# Altium schematic sheet LAN.SchDoc
size A4; SheetNumber: 4; SheetTotal: 8
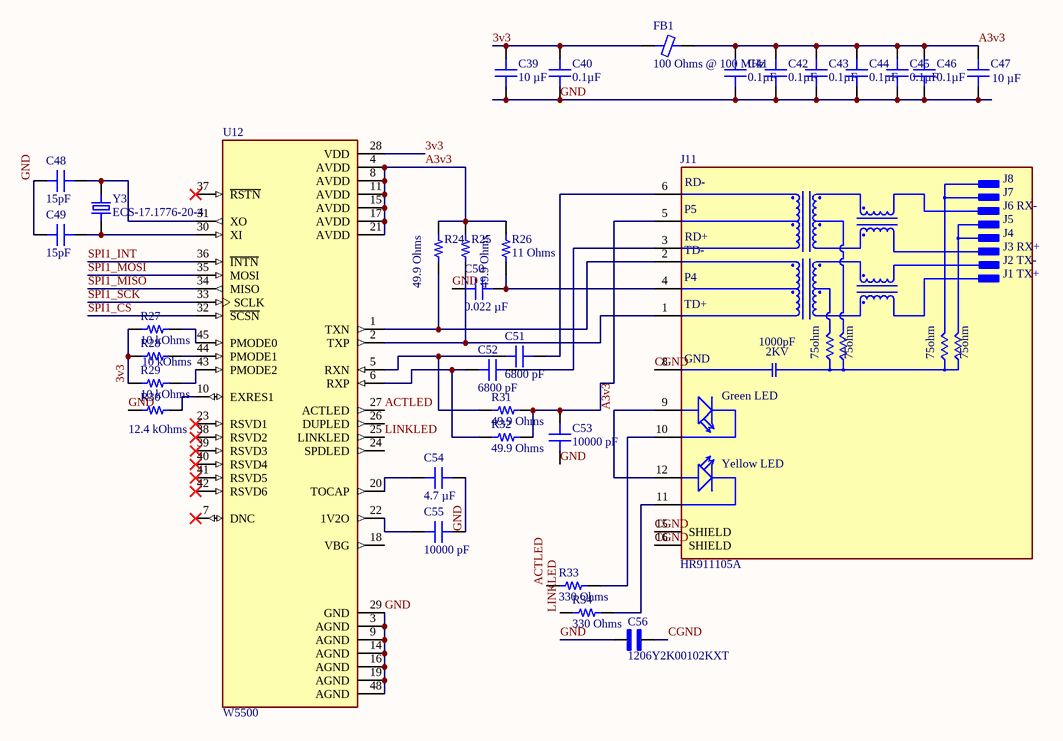
[diagram p0: LAN.SchDoc]

## Parts
C39  10 µF  [CAP 1206_3216 - 0.8MM]
C40  Capacitance: 0.1µF  [CAP 0805_2012]  (hidden comment: 1µF)
C41  Capacitance: 0.1µF  [CAP 0805_2012]  (hidden comment: 1µF)
C42  Capacitance: 0.1µF  [CAP 0805_2012]  (hidden comment: 1µF)
C43  Capacitance: 0.1µF  [CAP 0805_2012]  (hidden comment: 1µF)
C44  Capacitance: 0.1µF  [CAP 0805_2012]  (hidden comment: 1µF)
C45  Capacitance: 0.1µF  [CAP 0805_2012]  (hidden comment: 1µF)
C46  Capacitance: 0.1µF  [CAP 0805_2012]  (hidden comment: 1µF)
C47  10 µF  [CAP 1206_3216 - 0.8MM]
C48  15pF  [CAP 0805_2012]
C49  15pF  [CAP 0805_2012]
C50  0.022 µF  [CAP 0805_2012]
C51  6800 pF  [CAP 0805_2012]
C52  6800 pF  [CAP 0805_2012]
C53  10000 pF  [CAP 0805_2012]
C54  4.7 µF  [CAP 0805_2012]
C55  10000 pF  [CAP 0805_2012]
C56  1206Y2K00102KXT  [CAPC3216X160N]
FB1  100 Ohms @ 100 MHz  [FER 0805_2012]
J11  HR911105A  [HANRUN_HR911105A]
R24  49.9 Ohms  [RES 0805_2012]
R25  49.9 Ohms  [RES 0805_2012]
R26  11 Ohms  [RES 0805_2012]
R27  10 kOhms  [RES 0805_2012]
R28  10 kOhms  [RES 0805_2012]
R29  10 kOhms  [RES 0805_2012]
R30  12.4 kOhms  [RES 0805_2012]
R31  49.9 Ohms  [RES 0805_2012]
R32  49.9 Ohms  [RES 0805_2012]
R33  330 Ohms  [YAGEO RES 0805_2012]
R34  330 Ohms  [YAGEO RES 0805_2012]
U12  W5500  [QFP50P900X900X160-48N]
Y3  ECS-17.1776-20-4  [XTAL_ECS-160-20-4X]

## Nets
3v3: C39.2 C40.2 FB1.1 R27.1 R28.1 R29.1 U12.28(VDD)
A3v3: C41.2 C42.2 C43.2 C44.2 C45.2 C46.2 C47.2 FB1.2 J11.9(GA) J11.12(YA) R24.2 R25.2 R26.2 U12.4(AVDD) U12.8(AVDD) U12.11(AVDD) U12.15(AVDD) U12.17(AVDD) U12.21(AVDD)
ACTLED: R33.1 U12.27(ACTLED)
CGND: C56.2 J11.8(GND) J11.15(SHIELD) J11.16(SHIELD)
GND: C39.1 C40.1 C41.1 C42.1 C43.1 C44.1 C45.1 C46.1 C47.1 C48.1 C49.1 C50.2 C53.1 C54.2 C55.2 C56.1 R30.1 U12.3(AGND) U12.9(AGND) U12.14(AGND) U12.16(AGND) U12.19(AGND) U12.29(GND) U12.48(AGND)
LINKLED: R34.1 U12.25(LINKLED)
SPI1_CS: U12.32(~{SCSN})
SPI1_INT: U12.36(~{INTN})
SPI1_MISO: U12.34(MISO)
SPI1_MOSI: U12.35(MOSI)
SPI1_SCK: U12.33(SCLK)
NetC48_2: C48.2 U12.31(XO) Y3.2
NetC49_2: C49.2 U12.30(XI) Y3.1
NetC50_1: C50.1 J11.4(P4) R26.1
NetC51_1: C51.1 R31.2 U12.5(RXN)
NetC51_2: C51.2 J11.6(RD-)
NetC52_1: C52.1 R32.2 U12.6(RXP)
NetC52_2: C52.2 J11.3(RD+)
NetC53_2: C53.2 J11.5(P5) R31.1 R32.1
NetC54_1: C54.1 U12.20(TOCAP)
NetC55_1: C55.1 U12.22(1V2O)
NetJ11_1: J11.1(TD+) R25.1 U12.2(TXP)
NetJ11_2: J11.2(TD-) R24.1 U12.1(TXN)
NetJ11_10: J11.10(GC) R33.2
NetJ11_11: J11.11(YC) R34.2
NetR27_2: R27.2 U12.45(PMODE0)
NetR28_2: R28.2 U12.44(PMODE1)
NetR29_2: R29.2 U12.43(PMODE2)
NetR30_2: R30.2 U12.10(EXRES1)

Not connected (* = marked no-connect by the designer): U12 7(DNC)* 18(VBG) 23(RSVD1)* 24(SPDLED) 26(DUPLED) 37(~{RSTN})* 38(RSVD2)* 39(RSVD3)* 40(RSVD4)* 41(RSVD5)* 42(RSVD6)*

## Notes on the sheet
- (in symbol HR911105A) J8; J7; J6 RX-; J5; J4; J3 RX+; J2 TX-; J1 TX+; 1000pF; 2KV; 75ohm; Green LED; Yellow LED

## Library data of the parts
C39 C47 = EMK316BJ106MD-T: CAP CER 10UF 16V X5R 1206; manufacturer: Taiyo Yuden; Tolerance: ±20%; Part Number: EMK316BJ106MD-T; Capacitance: 10 µF; Applications: SMPS Filtering; componentlink1description: Datasheet; componentlink1url: http://www.yuden.co.jp/productdata/catalog/mlcc06_e.pdf; componentlink2description: DigiKey Link; componentlink2url: https://www.digikey.com/en/products/detail/taiyo-yuden/EMK316BJ106MD-T/6563474; Device Package: 1206 (3216 Metric); lastupdated: 04-06-2024 7.10.41 PM; Lifecycle Status: Active; Minimum Order: 1; Mounting Type: Surface Mount, MLCC; Operating Temperature: -55°C ~ 85°C; Package / Case: 1206 (3216 Metric); packaging: TapeAndReel; partid: 18996; Part Status: Active; price: 0.04; series: M; Size / Dimension: 0.126" L x 0.063" W (3.20mm x 1.60mm); Supplier 1: DigiKey; Supplier Part Number 1: 587-4881-1-ND; Temperature Coefficient: X5R; Thickness (Max): 0.037" (0.95mm); value: 10 µF; Voltage - Rated: 16V
C40-C46 = 0805ZC105KAT4A: CAP CER 1UF 10V X7R 0805; manufacturer: AVX Corporation; Tolerance: ±10%; Part Number: 0805ZC105KAT4A; Applications: General Purpose; componentlink1description: Datasheet; componentlink1url: http://datasheets.avx.com/X7RDielectric.pdf; componentlink2description: DigiKey Link; componentlink2url: http://digikey.com/product-detail/en/avx-corporation/0805ZC105KAT4A/478-7604-1-ND/7536237; Device Package: 0805 (2012 Metric); lastupdated: 02-09-2020 1.04.40 AM; Lifecycle Status: Active; Minimum Order: 1; Mounting Type: Surface Mount, MLCC; Operating Temperature: -55°C ~ 125°C; Package / Case: 0805 (2012 Metric); packaging: TapeAndReel; partid: 3500; Part Status: Active; price: 0.17; series: -; Size / Dimension: 0.079" L x 0.049" W (2.00mm x 1.25mm); Supplier 1: DigiKey; Supplier Part Number 1: 478-7604-1-ND; Temperature Coefficient: X7R; Thickness (Max): 0.037" (0.94mm); value: 1µF; Voltage - Rated: 10V
C48 C49 = 08055A150JAT2A: CAP CER 15PF 50V C0G/NP0 0805; manufacturer: AVX Corporation; Temperature Coefficient: C0G, NP0; Tolerance: ±5%; Part Number: 08055A150JAT2A; Capacitance: 15pF; Applications: General Purpose; componentlink1description: Datasheet; componentlink1url: http://datasheets.avx.com/C0GNP0-Dielectric.pdf; componentlink2description: DigiKey Link; componentlink2url: http://digikey.com/product-detail/en/avx-corporation/08055A150JAT2A/478-1306-1-ND/564338; Device Package: 0805 (2012 Metric); lastupdated: 02-09-2020 1.04.40 AM; Lifecycle Status: Active; Minimum Order: 1; Mounting Type: Surface Mount, MLCC; Operating Temperature: -55°C ~ 125°C; Package / Case: 0805 (2012 Metric); packaging: TapeAndReel; partid: 3213; Part Status: Active; price: 0.02; series: -; Size / Dimension: 0.079" L x 0.049" W (2.01mm x 1.25mm); Supplier 1: DigiKey; Supplier Part Number 1: 478-1306-1-ND; Thickness (Max): 0.037" (0.94mm); value: 15pF; Voltage - Rated: 50V
C50 = C0805C223K5RECAUTO: CAP CER 0805 22NF 50V X7R 10%; manufacturer: KEMET; Part Number: C0805C223K5RECAUTO; Capacitance: 0.022 µF; Applications: Automotive, ESD Protection; componentlink1description: Datasheet; componentlink1url: https://api.kemet.com/component-edge/download/datasheet/C0805C223K5RECAUTO.pdf; componentlink2description: DigiKey Link; componentlink2url: https://www.digikey.com/en/products/detail/kemet/C0805C223K5RECAUTO/8640480; Device Package: 0805 (2012 Metric); lastupdated: 09-02-2024 8.15.30 PM; Lifecycle Status: Active; Minimum Order: 1; Mounting Type: Surface Mount, MLCC; Operating Temperature: -55°C ~ 125°C; Package / Case: 0805 (2012 Metric); packaging: TapeAndReel; partid: 15719; Part Status: Active; price: 0.04; Ratings: AEC-Q200; series: ESD SMD Auto X7R; Size / Dimension: 0.079" L x 0.049" W (2.00mm x 1.25mm); Supplier 1: DigiKey; Supplier Part Number 1: 399-17886-1-ND; Temperature Coefficient: X7R; Thickness (Max): 0.035" (0.88mm); Tolerance: ±10%; value: 0.022 µF; Voltage - Rated: 50V
C51 C52 = C0805C682M3GEC7800: CAP CER 0805 6.8NF 25V C0G 20%; manufacturer: KEMET; Temperature Coefficient: C0G, NP0; Part Number: C0805C682M3GEC7800; Capacitance: 6800 pF; Applications: ESD Protection; componentlink1description: Datasheet; componentlink1url: https://connect.kemet.com:7667/gateway/IntelliData-ComponentDocumentation/1.0/download/datasheet/C0805C682M3GEC7800; componentlink2description: DigiKey Link; componentlink2url: https://www.digikey.com/en/products/detail/kemet/C0805C682M3GEC7800/8644610; Device Package: 0805 (2012 Metric); Features: Low ESL; lastupdated: 09-02-2024 8.14.56 PM; Lifecycle Status: Active; Minimum Order: 1; Mounting Type: Surface Mount, MLCC; Operating Temperature: -55°C ~ 125°C; Package / Case: 0805 (2012 Metric); packaging: TapeAndReel; partid: 46454; Part Status: Active; price: 0.06; series: ESD SMD Comm C0G; Size / Dimension: 0.079" L x 0.049" W (2.00mm x 1.25mm); Supplier 1: DigiKey; Supplier Part Number 1: 399-C0805C682M3GEC7800CT-ND; Thickness (Max): 0.055" (1.40mm); Tolerance: ±20%; value: 6800 pF; Voltage - Rated: 25V
C53 C55 = C0805X103K1RAC3316: CAP CER 0805 10NF 100V X7R; manufacturer: KEMET; Tolerance: ±10%; Part Number: C0805X103K1RAC3316; Capacitance: 10000 pF; Applications: Automotive, Boardflex Sensitive; componentlink1description: Datasheet; componentlink1url: https://api.kemet.com/component-edge/download/datasheet/C0805X103K1RAC3316.pdf; componentlink2description: DigiKey Link; componentlink2url: https://www.digikey.com/en/products/detail/kemet/C0805X103K1RAC3316/10315780; Device Package: 0805 (2012 Metric); Features: Soft Termination; lastupdated: 09-02-2024 8.16.09 PM; Lifecycle Status: Active; Minimum Order: 1; Mounting Type: Surface Mount, MLCC; Operating Temperature: -55°C ~ 125°C; Package / Case: 0805 (2012 Metric); packaging: TapeAndReel; partid: 2565; Part Status: Active; price: 0.02; Ratings: AEC-Q200; series: SMD Auto X7R VW80808; Size / Dimension: 0.079" L x 0.049" W (2.00mm x 1.25mm); Supplier 1: DigiKey; Supplier Part Number 1: 399-C0805X103K1RAC3316CT-ND; Temperature Coefficient: X7R; Thickness (Max): 0.039" (0.98mm); value: 10000 pF; Voltage - Rated: 100V
C54 = C0805X475M3RAC7800: 4.70UF 25.0V; manufacturer: KEMET; Temperature Coefficient: X7R; Tolerance: ±20%; Voltage - Rated: 25V; Part Number: C0805X475M3RAC7800; Capacitance: 4.7 µF; Applications: Boardflex Sensitive; componentlink1description: Datasheet; componentlink1url: https://connect.kemet.com:7667/gateway/IntelliData-ComponentDocumentation/1.0/download/datasheet/C0805X475M3RAC7800; componentlink2description: DigiKey Link; componentlink2url: https://www.digikey.com/en/products/detail/kemet/C0805X475M3RAC7800/12082671; Device Package: 0805 (2012 Metric); Features: Soft Termination; lastupdated: 09-02-2024 8.14.56 PM; Lifecycle Status: Active; Minimum Order: 1; Mounting Type: Surface Mount, MLCC; Operating Temperature: -55°C ~ 125°C; Package / Case: 0805 (2012 Metric); packaging: TapeAndReel; partid: 46494; Part Status: Active; price: 0.14; series: SMD Comm X7R Flex; Size / Dimension: 0.079" L x 0.049" W (2.00mm x 1.25mm); Supplier 1: DigiKey; Supplier Part Number 1: 399-C0805X475M3RAC7800CT-ND; Thickness (Max): 0.057" (1.45mm); value: 4.7 µF
C56 = 1206Y2K00102KXT: 1000 pF Â±10% 2000V (2kV) Ceramic Capacitor X7R 1206 (3216 Metric); MF: Knowles Syfer; SnapEDA_Link: https://www.snapeda.com/parts/1206Y2K00102KXT/Knowles+Syfer/view-part/?ref=snap; Package: 3216 Knowles Syfer; Value: *; MP: 1206Y2K00102KXT; Check_prices: https://www.snapeda.com/parts/1206Y2K00102KXT/Knowles+Syfer/view-part/?ref=eda
FB1 = HRB0805S101K1.00FT: FERRITE BEAD, CHIP, 0805, 100 OH; Manufacturer: AEM, Inc.; Current Rating (Max): 1A; DC Resistance (DCR) (Max): 200mOhm; Number of Lines: 1; Part Number: HRB0805S101K1.00FT; ComponentLink2Description: DigiKey Link; ComponentLink2URL: https://www.digikey.com/en/products/detail/aem-inc/HRB0805S101K1-00FT/23025488; Device Package: 0805 (2012 Metric); Height (Max): 0.043" (1.10mm); Impedance @ Frequency: 100 Ohms @ 100 MHz; LastUpdated: 29-03-2026 8.09.51 PM; Lifecycle Status: Active; Minimum Order: 1; Mounting Type: Surface Mount; Operating Temperature: -55°C ~ 125°C; Package / Case: 0805 (2012 Metric); Packaging: TapeAndReel; PartId: 4402; Price: 158.37; Series: HRB; Size / Dimension: 0.079" L x 0.049" W (2.00mm x 1.25mm); Supplier 1: DigiKey; Supplier Part Number 1: 5433-HRB0805S101K1.00FTCT-ND; Value: 100 Ohms @ 100 MHz
J11 = HR911105A: DIP RJ45 Connector;; MF: hanrun; SnapEDA_Link: https://www.snapeda.com/parts/HR911105A/HanRun/view-part/?ref=snap; Package: None; MP: HR911105A; Check_prices: https://www.snapeda.com/parts/HR911105A/HanRun/view-part/?ref=eda; Price: None; Value: *; Availability: Not in stock
R24 R25 R31 R32 = RCC080549R9FKEA: RCC0805 100 49R9 1% ET1 E3; Manufacturer: Vishay Dale; Power (Watts): 0.25W, 1/4W; Temperature Coefficient: ±100ppm/°C; Part Number: RCC080549R9FKEA; Value: 49.9 Ohms; ComponentLink1Description: Datasheet; ComponentLink1URL: https://www.vishay.com/docs/20066/rcce3.pdf; ComponentLink2Description: DigiKey Link; ComponentLink2URL: https://www.digikey.com/en/products/detail/vishay-dale/RCC080549R9FKEA/12084236; Composition: Thick Film; Device Package: 0805 (2012 Metric); Features: Automotive AEC-Q200; Height - Seated (Max): 0.020" (0.50mm); LastUpdated: 08-02-2024 9.00.29 PM; Lifecycle Status: Active; Minimum Order: 1; Number of Terminations: 2; Operating Temperature: -55°C ~ 155°C; Package / Case: 0805 (2012 Metric); Packaging: TapeAndReel; PartId: 60620; Part Status: Active; Price: 0.02; Ratings: AEC-Q200; Resistance: 49.9 Ohms; Series: RCC e3; Size / Dimension: 0.079" L x 0.049" W (2.00mm x 1.25mm); Supplier 1: DigiKey; Supplier Part Number 1: 541-RCC080549R9FKEACT-ND; Supplier Device Package: 0805; Tolerance: ±1%
R26 = KTR10EZPF11R0: RES SMD 11 OHM 1% 1/8W 0805; Manufacturer: Rohm Semiconductor; Power (Watts): 0.125W, 1/8W; Temperature Coefficient: ±100ppm/°C; Part Number: KTR10EZPF11R0; Value: 11 Ohms; ComponentLink1Description: Datasheet; ComponentLink1URL: https://www.rohm.com/datasheet/KTR03EZPF/ktr-e; ComponentLink2Description: DigiKey Link; ComponentLink2URL: https://www.digikey.com/en/products/detail/rohm-semiconductor/KTR10EZPF11R0/4051740; Composition: Thick Film; Device Package: 0805 (2012 Metric); Features: Automotive AEC-Q200, High Voltage; Height - Seated (Max): 0.026" (0.65mm); LastUpdated: 08-02-2024 9.01.51 PM; Lifecycle Status: Active; Minimum Order: 1; Number of Terminations: 2; Operating Temperature: -55°C ~ 155°C; Package / Case: 0805 (2012 Metric); Packaging: TapeAndReel; PartId: 39009; Part Status: Active; Price: 0.02; Ratings: AEC-Q200; Resistance: 11 Ohms; Series: KTR; Size / Dimension: 0.079" L x 0.049" W (2.00mm x 1.25mm); Supplier 1: DigiKey; Supplier Part Number 1: RHM11AHCT-ND; Supplier Device Package: 0805; Tolerance: ±1%
R27-R29 = RNCS0805BKE10K0: RES 10K OHM 0.1% 1/10W 0805; Manufacturer: Stackpole Electronics Inc; Power (Watts): 0.1W, 1/10W; Temperature Coefficient: ±25ppm/°C; Part Number: RNCS0805BKE10K0; Value: 10 kOhms; ComponentLink1Description: Datasheet; ComponentLink1URL: https://www.seielect.com/catalog/sei-rncs_rnch.pdf; ComponentLink2Description: DigiKey Link; ComponentLink2URL: https://www.digikey.com/en/products/detail/stackpole-electronics-inc/RNCS0805BKE10K0/1800067; Composition: Thin Film; Device Package: 0805 (2012 Metric); Features: Anti-Corrosive, Automotive AEC-Q200, Moisture Resistant; Height - Seated (Max): 0.026" (0.65mm); LastUpdated: 08-02-2024 9.02.39 PM; Lifecycle Status: Active; Minimum Order: 1; Number of Terminations: 2; Operating Temperature: -55°C ~ 155°C; Package / Case: 0805 (2012 Metric); Packaging: TapeAndReel; PartId: 27713; Part Status: Active; Price: 0.07; Ratings: AEC-Q200; Resistance: 10 kOhms; Series: RNCS; Size / Dimension: 0.079" L x 0.049" W (2.00mm x 1.25mm); Supplier 1: DigiKey; Supplier Part Number 1: RNCS0805BKE10K0CT-ND; Supplier Device Package: 0805; Tolerance: ±0.1%
R30 = RQ73C2A12K4BTD: RES 12.4 KOHMS 0.1% 1/5W 0805; Manufacturer: TE Connectivity Passive Product; Power (Watts): 0.2W, 1/5W; Temperature Coefficient: ±10ppm/°C; Part Number: RQ73C2A12K4BTD; Value: 12.4 kOhms; ComponentLink1Description: Datasheet; ComponentLink1URL: //media.digikey.com/pdf/Data%20Sheets/Tyco%20Electronics%20P%20B%20PDFs/RQ73-0618%20v2.pdf; ComponentLink2Description: DigiKey Link; ComponentLink2URL: https://www.digikey.com/en/products/detail/te-connectivity-passive-product/RQ73C2A12K4BTD/9479810; Composition: Thin Film; Device Package: 0805 (2012 Metric); Features: Anti-Sulfur, Automotive AEC-Q200; Height - Seated (Max): 0.026" (0.65mm); LastUpdated: 08-02-2024 9.02.26 PM; Lifecycle Status: Active; Minimum Order: 1; Number of Terminations: 2; Operating Temperature: -55°C ~ 155°C; Package / Case: 0805 (2012 Metric); Packaging: TapeAndReel; PartId: 30590; Part Status: Active; Price: 0.24; Ratings: AEC-Q200; Resistance: 12.4 kOhms; Series: RQ73; Size / Dimension: 0.079" L x 0.049" W (2.00mm x 1.25mm); Supplier 1: DigiKey; Supplier Part Number 1: A139862CT-ND; Supplier Device Package: 0805; Tolerance: ±0.1%
R33 R34 = RC0805FR-07330RL: RES 330 OHM 1% 1/8W 0805; Manufacturer: Yageo; Power (Watts): 0.125W, 1/8W; Temperature Coefficient: ±100ppm/°C; Part Number: RC0805FR-07330RL; Value: 330 Ohms; ComponentLink1Description: Datasheet; ComponentLink1URL: https://www.yageo.com/upload/media/product/productsearch/datasheet/rchip/PYu-RC_Group_51_RoHS_L_10.pdf; ComponentLink2Description: DigiKey Link; ComponentLink2URL: https://www.digikey.com/en/products/detail/yageo/RC0805FR-07330RL/727866; Composition: Thick Film; Device Package: 0805 (2012 Metric); Features: Moisture Resistant; Height - Seated (Max): 0.024" (0.60mm); LastUpdated: 25-07-2024 9.20.25 AM; Lifecycle Status: Active; Minimum Order: 1; Number of Terminations: 2; Operating Temperature: -55°C ~ 155°C; Package / Case: 0805 (2012 Metric); Packaging: TapeAndReel; PartId: 32600; Part Status: Active; Price: 0.01; Resistance: 330 Ohms; Series: RC_L; Size / Dimension: 0.079" L x 0.049" W (2.00mm x 1.25mm); Supplier 1: DigiKey; Supplier Part Number 1: 311-330CRCT-ND; Supplier Device Package: 0805; Tolerance: ±1%
U12 = W5500: Hardwired TCP/IP embedded Ethernet controller; Availability: Unavailable; MP: W5500; Value: *; Price: None; Package: None
Y3 = ECS-17.1776-20-4: Crystals 17.1776MHz HC49S; MF: ECS International; SnapEDA_Link: https://www.snapeda.com/parts/ECS-17.1776-20-4/ECS/view-part/?ref=snap; Package: HC-49US ECS Inc.; Value: *; MP: ECS-17.1776-20-4; Check_prices: https://www.snapeda.com/parts/ECS-17.1776-20-4/ECS/view-part/?ref=eda